# EAGLE design THAT_1206_Breakout (EAGLE 7.7.0)
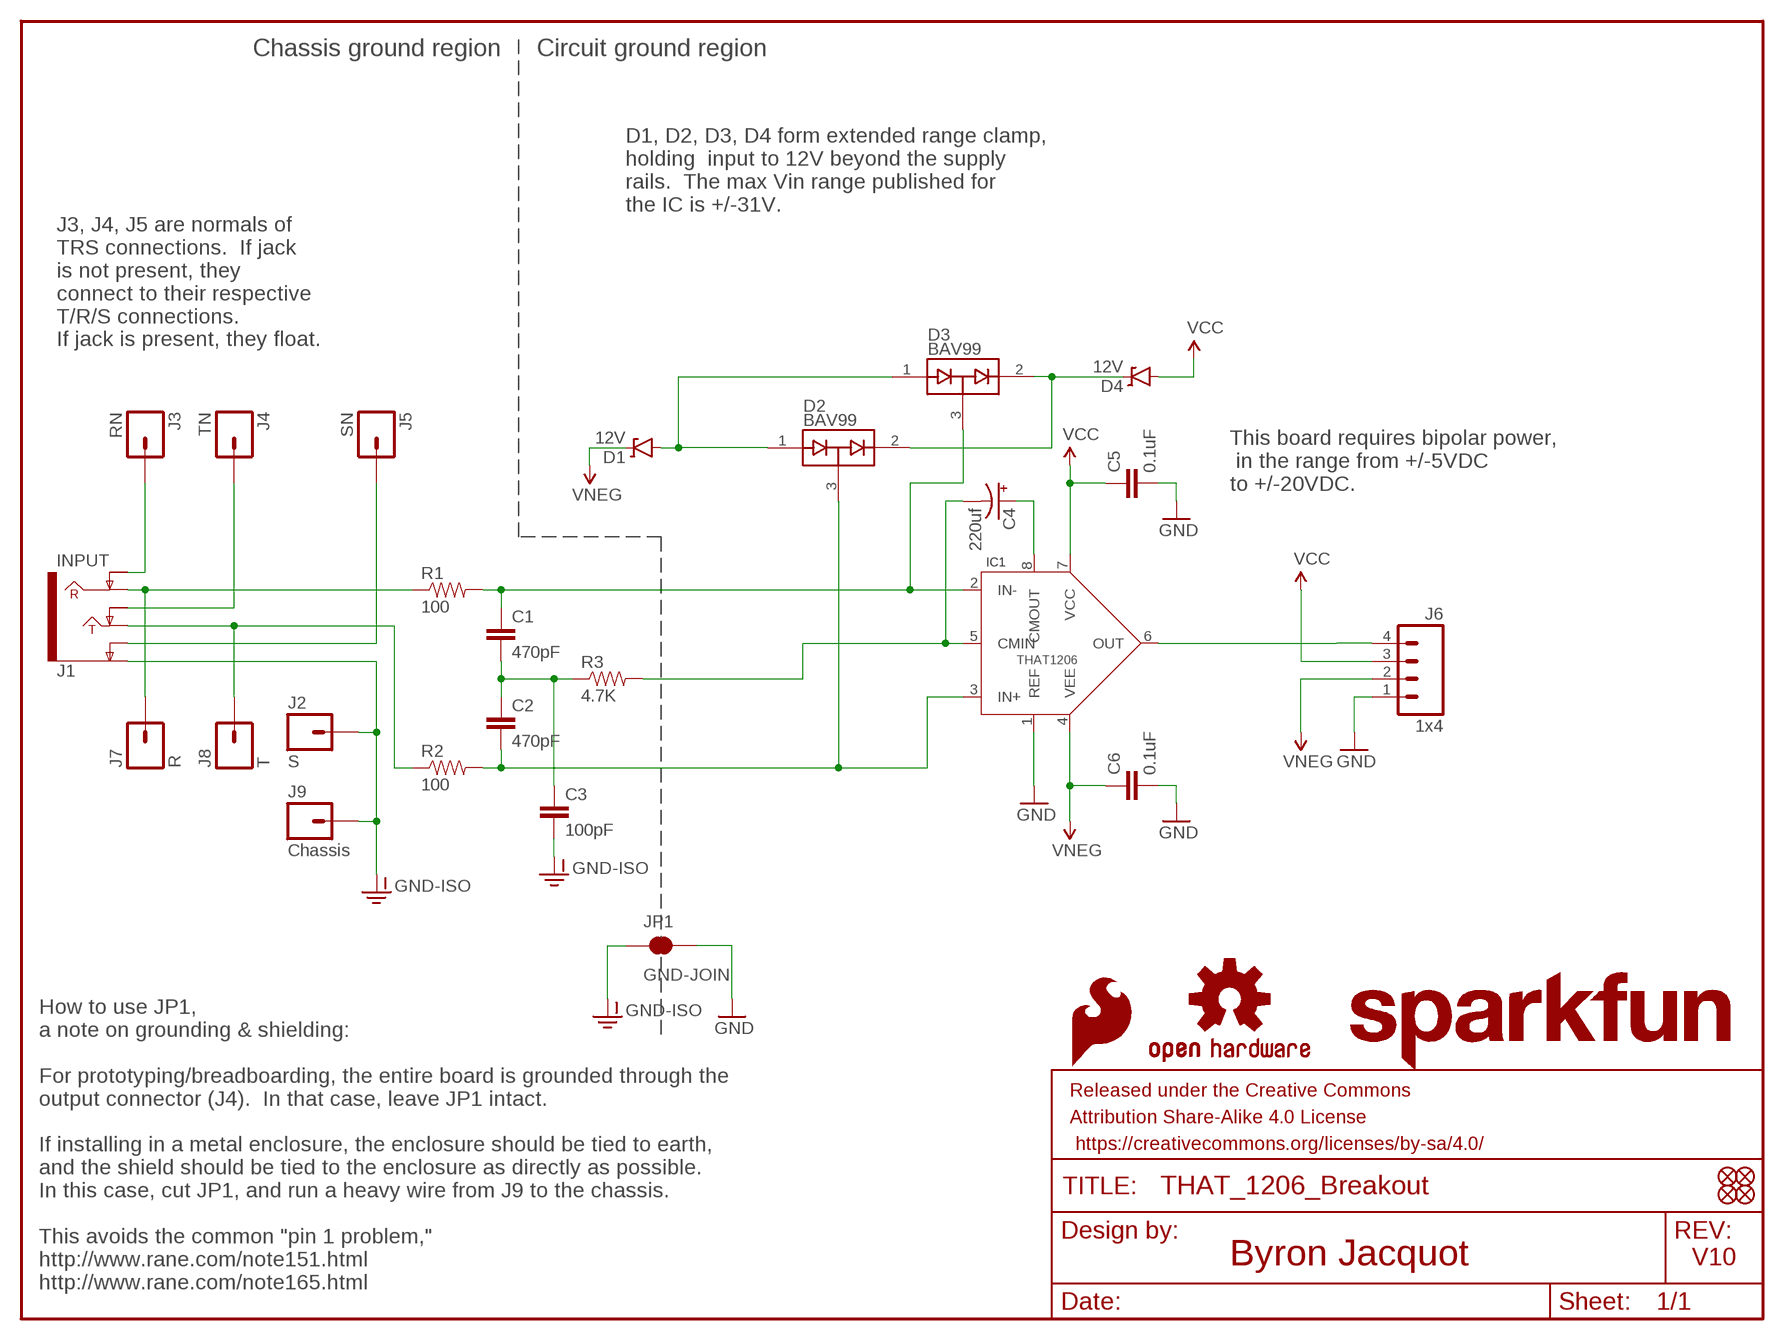
[diagram p0: schematic, sheet 1]

## Parts
C1  470pF  470PF-50V-5%(0603)SMD  [0603-CAP]
C2  470pF  470PF-50V-5%(0603)SMD  [0603-CAP]
C3  100pF  100PF-50V-5%(0603)  [0603-CAP]
C4  220uf  PANA-EEE-FKOJ221P  [PANASONIC_D]
C5  0.1uF  0.1UF-25V-5%(0603)  [0603-CAP]
C6  0.1uF  0.1UF-25V-5%(0603)  [0603-CAP]
D1  12V  12V-ZENER-DIODE  [SOD-323]
D2  BAV99  [SOT23-3]
D3  BAV99  [SOT23-3]
D4  12V  12V-ZENER-DIODE  [SOD-323]
FD1  FIDUCIALUFIDUCIAL  [MICRO-FIDUCIAL]
FD2  FIDUCIALUFIDUCIAL  [MICRO-FIDUCIAL]
FD3  FIDUCIALUFIDUCIAL  [MICRO-FIDUCIAL]
FD4  FIDUCIALUFIDUCIAL  [MICRO-FIDUCIAL]
FRAME1  FRAME-LETTER  [CREATIVE_COMMONS]
IC1  THAT1206  [SO08]
J1  INPUT  AUDIO_JACK_TRS_0.25"_PTH_RA  [AUDIO_JACK_0.25"_TRS_PTH_RA]
J2  S  M01PTH_NO_SILK_YES_STOP  [1X01_NO_SILK]
J3  RN  M01PTH_NO_SILK_YES_STOP  [1X01_NO_SILK]
J4  TN  M01PTH_NO_SILK_YES_STOP  [1X01_NO_SILK]
J5  SN  M01PTH_NO_SILK_YES_STOP  [1X01_NO_SILK]
J6  1x4  M04NO_SILK_ALL_ROUND  [1X04_NO_SILK_ALL_ROUND]
J7  R  M01PTH_NO_SILK_YES_STOP  [1X01_NO_SILK]
J8  T  M01PTH_NO_SILK_YES_STOP  [1X01_NO_SILK]
J9  Chassis  M01PTH_NO_SILK_YES_STOP  [1X01_NO_SILK]
JP1  GND-JOIN  JUMPER-PAD-2-NC_BY_TRACE  [PAD-JUMPER-2-NC_BY_TRACE_YES_SILK]
LOGO2  SFE_LOGO_FLAME.2_INCH  [SFE_LOGO_FLAME_.2]
LOGO3  OSHW-LOGOS  [OSHW-LOGO-S]
LOGO4  OSHW-LOGOS  [OSHW-LOGO-S]
LOGO5  SFE_LOGO_NAME.1_INCH  [SFE_LOGO_NAME_.1]
R1  100  100OHM-1/10W-1%(0603)  [0603-RES]
R2  100  100OHM-1/10W-1%(0603)  [0603-RES]
R3  4.7K  4.7KOHM-1/10W-1%(0603)  [0603-RES]

## Nets
GND: C5.2 C6.2 IC1.1(REF) J6.1 JP1.2
GND-ISO: C3.2 J1.SLEEVE(EARTH) J2.1 J9.1 JP1.1
N$1: J1.RING J7.1 R1.1
N$2: C1.1 D3.3(COM) IC1.2(IN-) R1.2
N$3: J1.TIP J8.1 R2.1
N$4: C2.2 D2.3(COM) IC1.3(IN+) R2.2
N$5: C1.2 C2.1 C3.1 R3.1
N$6: C4.- IC1.5(CMIN) R3.2
N$7: C4.+ IC1.8(CMOUT)
N$8: J1.SLEEVE-NORM(EARTH-NORM) J5.1
N$9: J1.TIP-NORM J4.1
N$10: J1.RING-NORM J3.1
N$12: D1.A D2.1(A1) D3.1(A1)
N$15: D2.2(C2) D3.2(C2) D4.C
RCV: IC1.6(OUT) J6.4
VCC: C5.1 D4.A IC1.7(VCC) J6.3
VNEG: C6.1 D1.C IC1.4(VEE) J6.2

## Notes on the sheet
- Chassis ground region | Circuit ground region
- D1, D2, D3, D4 form extended range clamp, 
  holding  input to 12V beyond the supply 
  rails.  The max Vin range published for 
  the IC is +/-31V.
- J3, J4, J5 are normals of 
  TRS connections.  If jack 
  is not present, they 
  connect to their respective 
  T/R/S connections.  
  If jack is present, they float.
- This board requires bipolar power,
   in the range from +/-5VDC 
  to +/-20VDC.
- How to use JP1,
  a note on grounding & shielding:
  
  For prototyping/breadboarding, the entire board is grounded through the 
  output connector (J4).  In that case, leave JP1 intact.
  
  If installing in a metal enclosure, the enclosure should be tied to earth, 
  and the shield should be tied to the enclosure as directly as possible.  
  In this case, cut JP1, and run a heavy wire from J9 to the chassis.
  
  This avoids the common "pin 1 problem," 
  http://www.rane.com/note151.html
  http://www.rane.com/note165.html
- Byron Jacquot | V10

## Library data of the parts
C1 C2 = SparkFun-Capacitors:470PF-50V-5%(0603): CAP-07884; PROD_ID: CAP-07884
C3 = SparkFun-Capacitors:100PF-50V-5%(0603): CAP-07883; PROD_ID: CAP-07883
C4 = that-ics:PANA-EEE-FKOJ221P: 220 uF 6.3 V cap. Panasonic EEE-FK0J221P digikey PCE3766TR-ND; PROD_ID: CAP-13470
C5 C6 = SparkFun-Capacitors:0.1UF-25V-5%(0603): CAP-08604; PROD_ID: CAP-08604
D1 D4 = that-ics:12V-ZENER-DIODE; DK_PN: MM3Z12VT1GOSCT-ND; MFR: ON Semi; MFR_PN: MM3Z12VT1G; PROD_ID: DIO-13471
D2 D3 = SparkFun-DiscreteSemi:BAV99: Two small signal silicon diodes connected anode to cathode. Connections to all three nodes available. DIO-10647; PROD_ID: DIO-10647
FD1-FD4 = SparkFun-Aesthetics:FIDUCIAL: Fiducial Alignment Points Various fiducial points for machine vision alignment.
FRAME1 = SparkFun-Aesthetics:FRAME-LETTER: Schematic Frame Standard 8.5x11 US Letter frame
IC1 = that-ics:THAT1206: THAT Corporation 1206 InGenius series balanced line receiver.; PROD_ID: IC-13469
J1 = SparkFun-Connectors:AUDIO_JACK_TRS_0.25"_PTH_RA: Audio Jack, 1/4" TRS jack, horizontal, PTH, aka "Phono jack" Find the connector here: Audio Jack - 1/4" Stereo (right angle) <https://www.sparkfun.com/products/11144> (COM-11144) Datasheet <http://cdn.sparkfun.com/datasheets/Components/General/JP-611%20DD.jpg> Note, although the datasheet and physical part are slightly different, this footprint was proven to mate well on the Proto Pedal. This device is used on these SparkFun Products: SparkFun TRS Jack Breakout - 1/4" Stereo <https://www.sparkfun.com/products/13005> (BOB-13005 ) SparkFun Proto Pedal - sorry bad link - product comming soon! <https://www.sparkfun.com/products/13124> (PRT-13124); PROD_ID: CONN-12339; SF_ID: COM-11144
J2-J5 J7-J9 = SparkFun-Connectors:M01: Header 1 Standard 1-pin 0.1" header. Use with straight break away headers (SKU : PRT-00116), right angle break away headers (PRT-00553), swiss pins (PRT-00743), machine pins (PRT-00117), and female headers (PRT-00115). SMTSO-256-ET is a "flush mount" nut for a 4-40 screw. The older package used to be too tight, and did not allow it to sit properly thru the drill hit. The latest (0.165DIA) fits nice and snug.
J6 = SparkFun-Connectors:M04: Header 4 Standard 4-pin 0.1" header. Use with straight break away headers (SKU : PRT-00116), right angle break away headers (PRT-00553), swiss pins (PRT-00743), machine pins (PRT-00117), and female headers (PRT-00115). Molex polarized connector foot print use with SKU : PRT-08231 with associated crimp pins and housings. 1MM SMD Version SKU: PRT-10208; PROD_ID: CONN-09696
JP1 = SparkFun-Passives:JUMPER-PAD-2-NC_BY_TRACE
LOGO2 = SparkFun-Aesthetics:SFE_LOGO_FLAME: SFE Logo, flame only This is the SparkFun flame logo. The logo on the schematic will always be the same size; the package variant is the height of the flame. Default layer for the logo on the board is tSilk.
LOGO3 LOGO4 = SparkFun-Aesthetics:OSHW-LOGO: Open Source Hardware Logo This logo indicates the piece of hardware it is found on incorporates a OSHW license and/or adheres to the definition of open source hardware found here: http://freedomdefined.org/OSHW
LOGO5 = SparkFun-Aesthetics:SFE_LOGO_NAME: SFE Logo, name only This is the SparkFun name logo. The logo on the schematic will always be the same size; the package variant is the height of the flame part of the logo (or the height the flame would be, if it were drawn). Default layer for the logo on the board is tSilk.
R1 R2 = SparkFun-Resistors:100OHM-1/10W-1%(0603): RES-07863; PROD_ID: RES-07863
R3 = SparkFun-Resistors:4.7KOHM-1/10W-1%(0603): RES-07857; PROD_ID: RES-07857

## Board
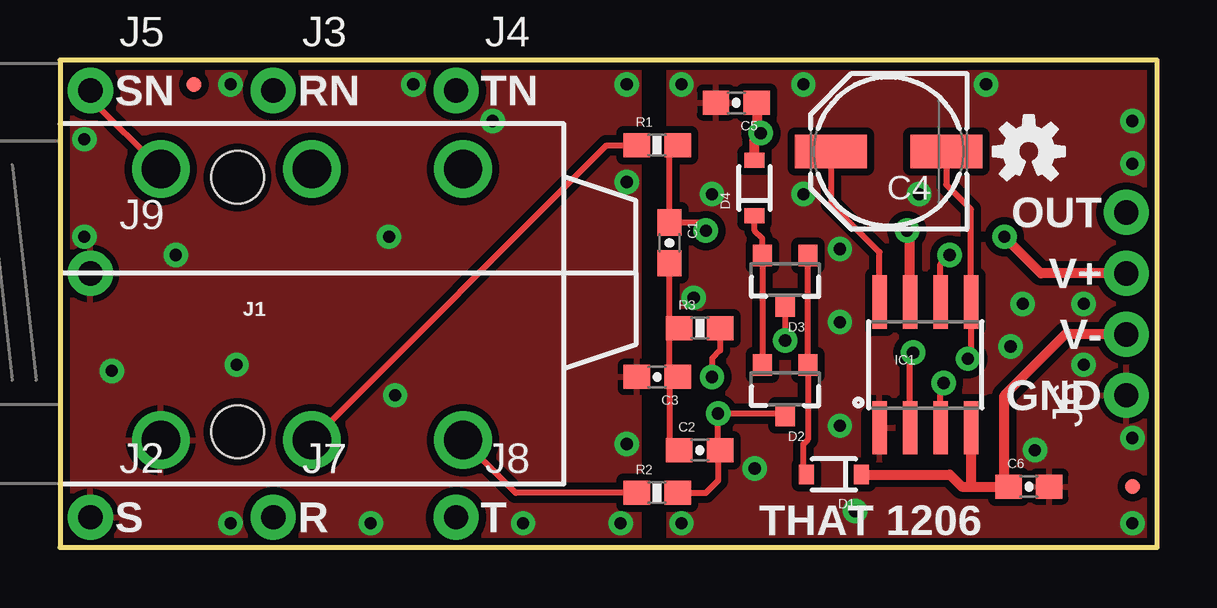
[diagram p1: board, top side]
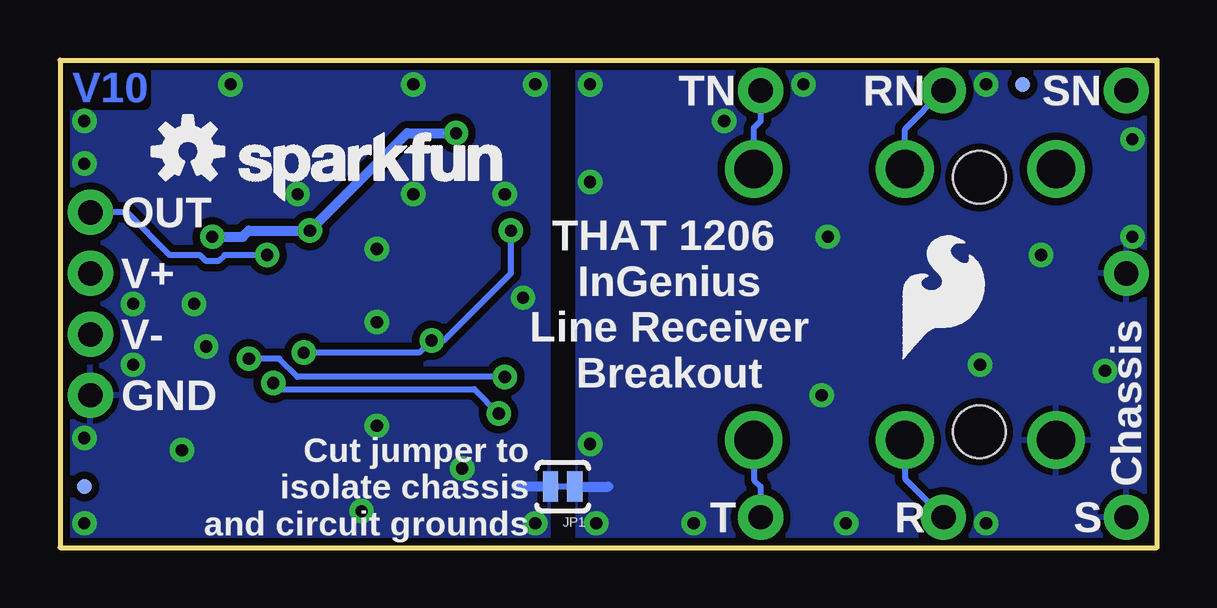
[diagram p2: board, bottom side, seen from below]

Size 45.72 x 20.32 mm. Coordinates in mm from the lower left corner, seen from the top.
Outline: 45.72,20.32 0,20.32 0,0 45.72,0 45.72,20.32
Copper layers (1*16): Top 0.035mm / dielectric 1.5mm / Bottom 0.035mm
Design rules "SparkFun-2-layer-STANDARD": minimum track width 10mil, minimum drill 20mil, track to track 10mil, track to pad 8mil, pad to pad 8mil, via to via 10mil, smd to smd 8mil, copper to edge 8mil, drill to drill 8mil, minimum pad ring 10mil, minimum via ring 10mil, stop-mask expansion 4mil, vias tented up to drill 25mil, thermal gap 10mil
tRestrict: area 33.7,4.4 to 33.7,5.6; area 33.7,3.7 to 33.7,4.8; area 38.8,4.7 to 38.8,5.8; area 38.8,5 to 38.8,6.1

### Footprints (pad centres in the part's own frame; a part is rotated, then mirrored left to right if it is on the bottom)
0603-CAP = smd 1.1 x 1: 1 -0.85,0; 2 0.85,0
PANASONIC_D = smd 3 x 1.4: + 2.4,0; - -2.4,0
SOD-323 = smd 0.63 x 0.83: A 1.15,0; C -1.15,0
SOT23-3 = smd 0.8 x 0.9: 1 -0.95,-1; 2 0.95,-1; 3 0,1.1
MICRO-FIDUCIAL = smd 0.635 x 0.635: 1 0,0
SO08 = smd 0.61 x 2.21: 1 -1.905,-2.616; 2 -0.635,-2.616; 3 0.635,-2.616; 4 1.905,-2.616; 5 1.905,2.616; 6 0.635,2.616; 7 -0.635,2.616; 8 -1.905,2.616
AUDIO_JACK_0.25"_TRS_PTH_RA = drill 1.6: RING 10.5,-6.95; RING-NORM 10.5,4.35; SLEEVE 4.2,-6.95; SLEEVE-NORM 4.2,4.35; TIP 16.8,-6.95; TIP-NORM 16.8,4.35 | hole 2.2: 7.4,4; 7.4,-6.6
1X01_NO_SILK = drill 1.016 pad 1.88: 1 0,0
1X04_NO_SILK_ALL_ROUND = drill 1.016 pad 1.88: 1 0,0; 2 2.54,0; 3 5.08,0; 4 7.62,0
PAD-JUMPER-2-NC_BY_TRACE_YES_SILK = smd 0.635 x 1.27: 1 -0.508,0; 2 0.508,0
0603-RES = smd 1.1 x 1: 1 -0.85,0; 2 0.85,0

### Placement (x,y rotation side)
C1  25.4,12.7 270 top
C2  26.67,4.06 0 top
C3  24.89,7.11 180 top
C4  34.54,16.51 180 top
C5  28.19,18.54 180 top
C6  40.39,2.54 0 top
D1  32.26,3.05 180 top
D2  30.23,6.62 180 top
D3  30.23,11.18 180 top
D4  28.96,14.99 90 top
FD1  5.59,19.3 0 bottom
FD2  44.7,2.54 0 bottom
FD3  5.59,19.3 0 top
FD4  44.7,2.54 0 top
FRAME1  16.51,-20.32 0 top  (outside the outline)
IC1  36.07,7.62 0 top
J1  0,11.43 0 top
J2  1.27,1.27 0 top
J3  8.89,19.05 0 top
J4  16.51,19.05 0 top
J5  1.27,19.05 0 top
J6  44.45,6.35 90 top
J7  8.89,1.27 0 top
J8  16.51,1.27 0 top
J9  1.27,11.43 0 top
JP1  24.77,2.54 180 bottom
LOGO2  10.92,7.62 0 bottom
LOGO3  40.39,16.51 0 bottom
LOGO4  40.39,16.51 0 top
LOGO5  38.73,13.97 0 bottom
R1  24.89,16.76 0 top
R2  24.89,2.29 0 top
R3  26.67,9.14 0 top

### Tracks (layer width: path | path; a pad name or v marks a point on that pad's centre or on a via)
GND  (via drill 0.51)
  Bottom 0.406: JP1.2 26.67,2.54
  other vias: 44.7,1.02 42.67,10.16 40.13,10.16 44.7,4.57 42.67,7.62 39.62,8.38 44.7,16 44.7,17.78 38.61,19.3 30.99,19.3 25.91,19.3 27.18,14.73 30.99,14.73 32.51,12.45 32.51,9.4 28.96,3.3 25.91,1.02 40.64,4.06 35.81,14.73 26.42,10.41 32.51,5.08 33.15,1.52
  pour Top (isolate 0.305): 45.72,20.32 45.72,0 25.4,0 25.4,20.32
  pour Bottom (isolate 0.305): 25.4,20.32 25.4,0 45.72,0 45.72,20.32
GND-ISO  (via drill 0.51)
  Bottom 0.406: JP1.1 22.86,2.54
  other vias: 7.11,19.3 7.37,7.62 1.02,12.95 2.16,7.37 7.11,1.02 12.95,1.02 23.37,1.02 13.72,12.95 18.03,17.78 23.62,19.3 13.97,6.35 23.62,15.24 23.62,4.32 1.02,17.02 4.83,12.19 14.73,19.3 19.3,1.02
  pour Bottom (isolate 0.305): 0,20.32 24.13,20.32 24.13,0 0,0
  pour Top (isolate 0.305): 24.13,20.32 0,20.32 0,0 24.13,0
N$1
  Top 0.254: J1.RING 22.78,16.76 R1.1
  Bottom 0.254: J1.RING 10.5,2.88 J7.1
N$2  (via drill 0.51)
  Top 0.254: R1.2 25.4,17.11 C1.1 26.58,13.55 v26.92,13.21 | D3.3 v30.23,8.64 | IC1.2 35.43,8 v35.56,8.13
  Bottom 0.254: v35.56,8.13 30.73,8.13 v30.23,8.64 29.72,8.64 26.92,11.43 v26.92,13.21
N$3
  Top 0.254: R2.1 18.99,2.29 J1.TIP
  Bottom 0.254: J8.1 16.51,2.54 16.76,2.79 16.76,4.44 J1.TIP
N$4  (via drill 0.51)
  Top 0.254: IC1.3 36.7,6.73 v36.83,6.86 | D2.3 30.16,5.59 v27.43,5.59 27.43,4.15 C2.2 27.43,3.98 27.43,2.79 26.92,2.29 R2.2
  Bottom 0.254: v36.83,6.86 36.58,6.6 28.45,6.6 v27.43,5.59
N$5
  Top 0.254: 25.4,9.14 25.4,7.11 C3.1 25.65,7.11 25.4,6.86 25.4,4.48 C2.1 | 25.4,9.14 C1.2 | R3.1 25.4,9.14
N$6  (via drill 0.51)
  Top 0.254: v37.85,7.87 37.97,8 IC1.5 37.97,14.1 36.94,15.13 C4.- | R3.2 27.52,8.22 27.18,7.87 v27.18,7.11
  Bottom 0.254: v27.18,7.11 35.81,7.11 36.58,7.87 v37.85,7.87
N$7
  Top 0.254: IC1.8 34.16,12.32 32.14,14.34 C4.+
N$8
  Top 0.254: J1.SLEEVE-NORM 1.27,18.71 J5.1
N$9
  Bottom 0.254: J1.TIP-NORM 16.8,17.49 16.51,17.78 J4.1
N$10
  Bottom 0.254: J1.RING-NORM 10.5,17.44 J3.1
N$12
  Top 0.254: D3.1 D2.1 31.18,4.51 30.99,4.32 30.99,3.17 D1.A
N$15
  Top 0.254: D2.2 D3.2 29.28,12.89 28.96,13.21 D4.C
RCV  (via drill 0.51)
  Top 0.254: IC1.6 36.7,11.81 v37.08,12.19
  Bottom 0.254: v37.08,12.19 38.86,12.19 39.12,11.94 39.62,11.94 39.88,12.19 41.15,12.19 42.93,13.97 J6.4
VCC  (via drill 0.51)
  Top 0.406: J6.3 40.89,11.43 v39.37,12.95 | IC1.7 35.43,13.08 v35.31,13.21 | C5.1 29.04,17.44 v29.21,17.27 28.96,17.02 D4.A
  Bottom 0.406: v39.37,12.95 38.1,12.95 37.85,13.21 v35.31,13.21 31.24,17.27 v29.21,17.27
VNEG
  Top 0.406: J6.2 41.91,8.89 39.37,6.35 39.37,2.71 C6.1 38.1,2.54 | D1.C 37.08,3.05 37.59,2.54 38.1,2.54 | IC1.4 37.97,2.67 38.1,2.54

### Text on the board
Bottom: V10
tPlace: SN | RN | TN | OUT | V+ | V- | GND | S | R | T | THAT 1206
bPlace: SN | RN | TN | OUT | V+ | THAT 1206 / InGenius / Line Receiver / Breakout | V- | GND | Chassis | S | R | T | Cut jumper to / isolate chassis / and circuit grounds
Measures: Drill 0.44" (11mm) hole to / accomodate TRS jack | All dimensions in inches.
tDocu: Byron Jacquot